# EAGLE design buck (EAGLE 9.5.2)
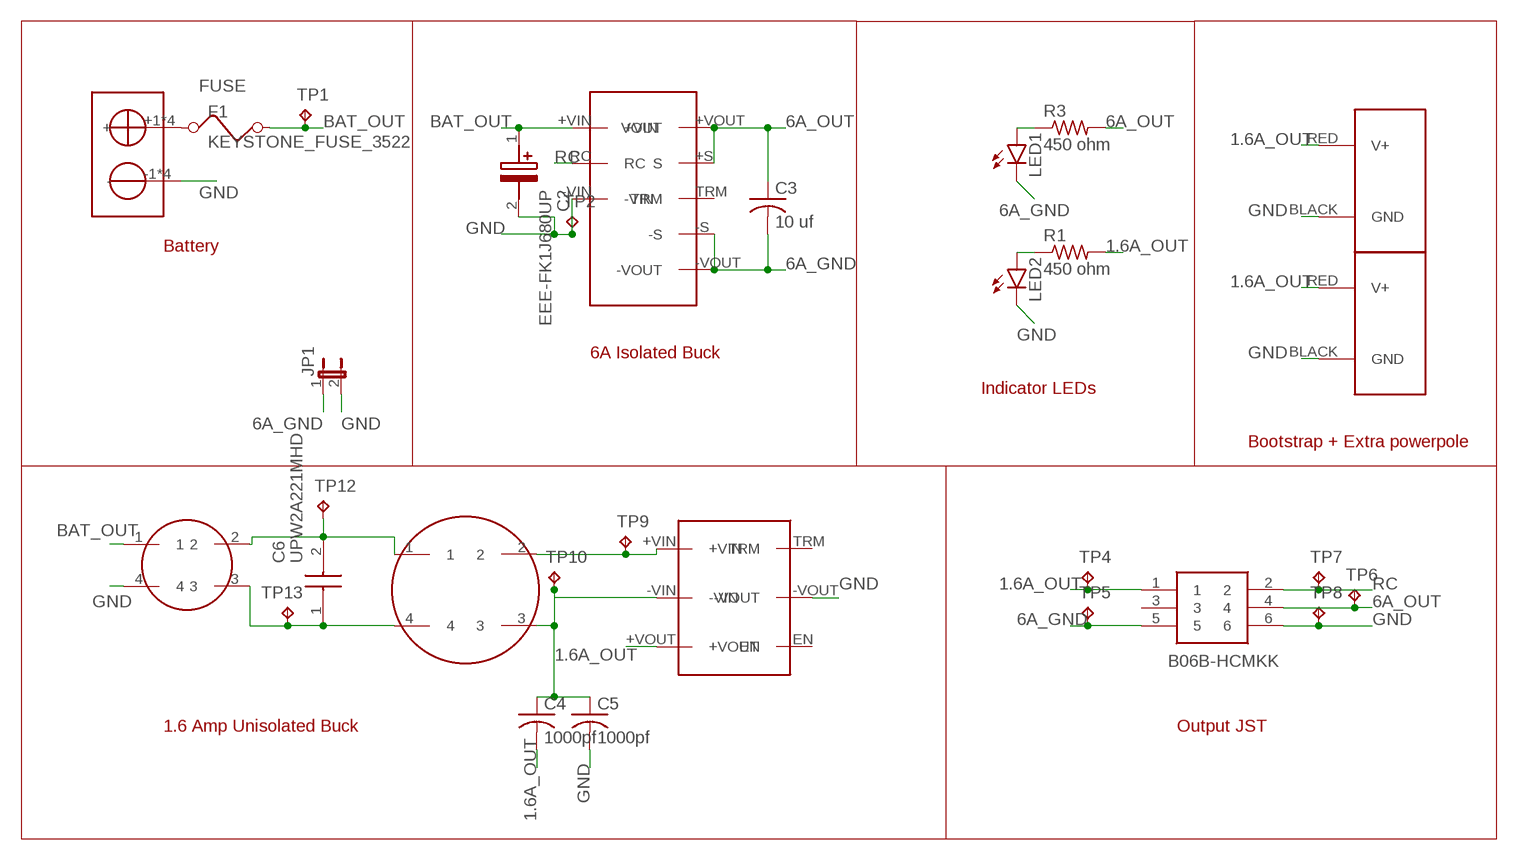
[diagram p0: schematic, sheet 1]

## Parts
BUCK150UH  CMNMODECHOKE150UH  [CMNMODECHOKE150UH]
C2  EEE-FK1J680UP  [CAPAE830X1050N]
C3  10 uf  C-USC0805  [C0805]
C4  1000pf  C-USC0805  [C0805]
C5  1000pf  C-USC0805  [C0805]
C6  UPW2A221MHD  [CAPPRD550W60D1050H1750]
CHOKEME  CMNMODECHOKE1.2MH  [CMNMODECHOKE1.2MH]
F1  KEYSTONE_FUSE_3522  [KEYSTONE_FUSE_3522]
J1  B06B-HCMKK  [B06BHCMKK]
J2  POWERPOLE_POWER45A_DRILL  [POWERPOLE_PAIR_45A_HOLE]
J3  POWERPOLE_POWER45A_DRILL  [POWERPOLE_PAIR_45A_HOLE]
JP1  JP1E  [JP1]
LED1  LEDCHIP-LED0603  [CHIP-LED0603]
LED2  LEDCHIP-LED0603  [CHIP-LED0603]
R1  450 ohm  R-US_R0805  [R0805]
R3  450 ohm  R-US_R0805  [R0805]
TP1  TPPAD1-13  [P1-13]
TP2  TPPAD1-13  [P1-13]
TP4  TPPAD1-13  [P1-13]
TP5  TPPAD1-13  [P1-13]
TP6  TPPAD1-13  [P1-13]
TP7  TPPAD1-13  [P1-13]
TP8  TPPAD1-13  [P1-13]
TP9  TPPAD1-13  [P1-13]
TP10  TPPAD1-13  [P1-13]
TP12  TPPAD1-13  [P1-13]
TP13  TPPAD1-13  [P1-13]
U$1  12V6ABUCKCONVERTER  [12V6ABUCKCONVERTER]
U$2  SB50  [MINI-SB-50]
U$3  BUCK1.6A  [BUCK1.6A]

## Nets
1.6A_OUT: C4.2 J1.1 J2.RED(V+) J3.RED(V+) R1.2 TP4.TP U$3.+VOUT
6A_GND [Power]: C3.2 J1.5 JP1.1 LED1.C TP5.TP U$1.-S U$1.-VOUT
6A_OUT [Power]: C3.1 J1.4 R3.2 TP6.TP U$1.+S(S) U$1.+VOUT(VOUT)
BAT_OUT [Power]: BUCK150UH.1 C2.1(+) F1.B1 F1.B2 TP1.TP U$1.+VIN
FUSE [Power]: F1.A1 F1.A2 U$2.+1(+) U$2.+2(+) U$2.+3(+) U$2.+4(+)
GND [Power]: BUCK150UH.4 C2.2(-) C5.2 J1.6 J2.BLACK(GND) J3.BLACK(GND) JP1.2 LED2.C TP2.TP TP8.TP U$1.-VIN U$2.-1(-) U$2.-2(-) U$2.-3(-) U$2.-4(-) U$3.-VOUT
N$1: BUCK150UH.2 C6.2(-) CHOKEME.1 TP12.TP
N$4: BUCK150UH.3 C6.1(+) CHOKEME.4 TP13.TP
N$6: CHOKEME.2 TP9.TP U$3.+VIN
N$8: C4.1 C5.1 CHOKEME.3 TP10.TP U$3.-VIN
N$10: LED2.A R1.1
N$24: LED1.A R3.1
RC: J1.2 TP7.TP U$1.RC
Unconnected: J1.3 U$1.TRM U$3.EN U$3.TRM

## Notes on the sheet
- Battery
- 6A Isolated Buck
- Indicator LEDs
- Bootstrap + Extra powerpole
- 1.6 Amp Unisolated Buck | Output JST

## Library data of the parts
BUCK150UH = cmnModeChoke150uH:CMNMODECHOKE150UH
C2 = SamacSys_Parts:EEE-FK1J680UP: Aluminum Electrolytic Capacitors - SMD 68UF 63V FK SMD Source: Datasheet <https://componentsearchengine.com/Datasheets/1/EEE-FK1J680UP.pdf>; DESCRIPTION: Aluminum Electrolytic Capacitors - SMD 68UF 63V FK SMD; HEIGHT: 10.5mm; MANUFACTURER_NAME: Panasonic; MANUFACTURER_PART_NUMBER: EEE-FK1J680UP; MOUSER_PART_NUMBER: 667-EEE-FK1J680UP; MOUSER_PRICE-STOCK: https://www.mouser.com/Search/Refine.aspx?Keyword=667-EEE-FK1J680UP
C3-C5 = rcl:C-US: CAPACITOR, American symbol; SPICEPREFIX: C
C6 = SamacSys_Parts:UPW2A221MHD: Nichicon 220F +/-20% 100 V dc Through Hole Radial Aluminium Electrolytic Capacitor Source: Datasheet <https://componentsearchengine.com/Datasheets/1/UPW2A221MHD.pdf>; DESCRIPTION: Nichicon 220F +/-20% 100 V dc Through Hole Radial Aluminium Electrolytic Capacitor; HEIGHT: 17.5mm; MANUFACTURER_NAME: Nichicon; MANUFACTURER_PART_NUMBER: UPW2A221MHD; MOUSER_PART_NUMBER: 647-UPW2A221MHD; MOUSER_PRICE-STOCK: https://www.mouser.com/Search/Refine.aspx?Keyword=647-UPW2A221MHD
CHOKEME = cmnModeChoke1.2mH:CMNMODECHOKE1.2MH
F1 = AUX Lib:KEYSTONE_FUSE_3522
J1 = B06B-HCMKK:B06B-HCMKK: Automotive Connectors 6P AIT Header Top Position (BLK) Source: Datasheet <https://componentsearchengine.com/Datasheets/1/B06B-HCMKK.pdf>; DESCRIPTION: Automotive Connectors 6P AIT Header Top Position (BLK); HEIGHT: 13.7mm; MANUFACTURER_NAME: JST (JAPAN SOLDERLESS TERMINALS); MANUFACTURER_PART_NUMBER: B06B-HCMKK; MOUSER_PART_NUMBER: 306-B06B-HCMKK; MOUSER_PRICE-STOCK: https://www.mouser.com/Search/Refine.aspx?Keyword=306-B06B-HCMKK
J2 J3 = powerpoles:POWERPOLE_POWER: Anderson Powerpole Power Connector using ameteur radio standard layout
JP1 = jumper:JP1E: JUMPER
LED1 LED2 = led:LED: LED OSRAM: - CHIPLED LG R971, LG N971, LY N971, LG Q971, LY Q971, LO R971, LY R971 LH N974, LH R974 LS Q976, LO Q976, LY Q976 LO Q996 - Hyper CHIPLED LW Q18S LB Q993, LB Q99A, LB R99A - SideLED LS A670, LO A670, LY A670, LG A670, LP A670 LB A673, LV A673, LT A673, LW A673 LH A674 LY A675 LS A676, LA A676, LO A676, LY A676, LW A676 LS A679, LY A679, LG A679 - Hyper Micro SIDELED® LS Y876, LA Y876, LO Y876, LY Y876 LT Y87S - SmartLED LW L88C, LW L88S LB L89C, LB L89S, LG L890 LS L89K, LO L89K, LY L89K LS L896, LA L896, LO L896, LY L896 - TOPLED LS T670, LO T670, LY T670, LG T670, LP T670 LSG T670, LSP T670, LSY T670, LOP T670, LYG T670 LG T671, LOG T671, LSG T671 LB T673, LV T673, LT T673, LW T673 LH T674 LS T676, LA T676, LO T676, LY T676, LB T676, LH T676, LSB T676, LW T676 LB T67C, LV T67C, LT T67C, LS T67K, LO T67K, LY T67K, LW E67C LS E67B, LA E67B, LO E67B, LY E67B, LB E67C, LV E67C, LT E67C LW T67C LS T679, LY T679, LG T679 LS T770, LO T770, LY T770, LG T770, LP T770 LB T773, LV T773, LT T773, LW T773 LH T774 LS E675, LA E675, LY E675, LS T675 LS T776, LA T776, LO T776, LY T776, LB T776 LHGB T686 LT T68C, LB T68C - Hyper Mini TOPLED® LB M676 - Mini TOPLED Santana® LG M470 LS M47K, LO M47K, LY M47K Source: http://www.osram.convergy.de LUXEON: - LUMILED® LXK2-PW12-R00, LXK2-PW12-S00, LXK2-PW14-U00, LXK2-PW14-V00 LXK2-PM12-R00, LXK2-PM12-S00, LXK2-PM14-U00 LXK2-PE12-Q00, LXK2-PE12-R00, LXK2-PE12-S00, LXK2-PE14-T00, LXK2-PE14-U00 LXK2-PB12-K00, LXK2-PB12-L00, LXK2-PB12-M00, LXK2-PB14-N00, LXK2-PB14-P00, LXK2-PB14-Q00 LXK2-PR12-L00, LXK2-PR12-M00, LXK2-PR14-Q00, LXK2-PR14-R00 LXK2-PD12-Q00, LXK2-PD12-R00, LXK2-PD12-S00 LXK2-PH12-R00, LXK2-PH12-S00 LXK2-PL12-P00, LXK2-PL12-Q00, LXK2-PL12-R00 Source: www.luxeon.com KINGBRIGHT: KA-3528ASYC Source: www.kingbright.com
R1 R3 = rcl:R-US_: RESISTOR, American symbol; SPICEPREFIX: R
TP1 TP2 TP4-TP10 TP12 TP13 = testpad:TP: Test pad
U$1 = 12v6aBuckConverter:12V6ABUCKCONVERTER
U$2 = REV BLDC:SB50
U$3 = buck_1.6:BUCK1.6A

## Net classes
0 default: width 0.762 mm
1 Power: width 1.524 mm

## Board
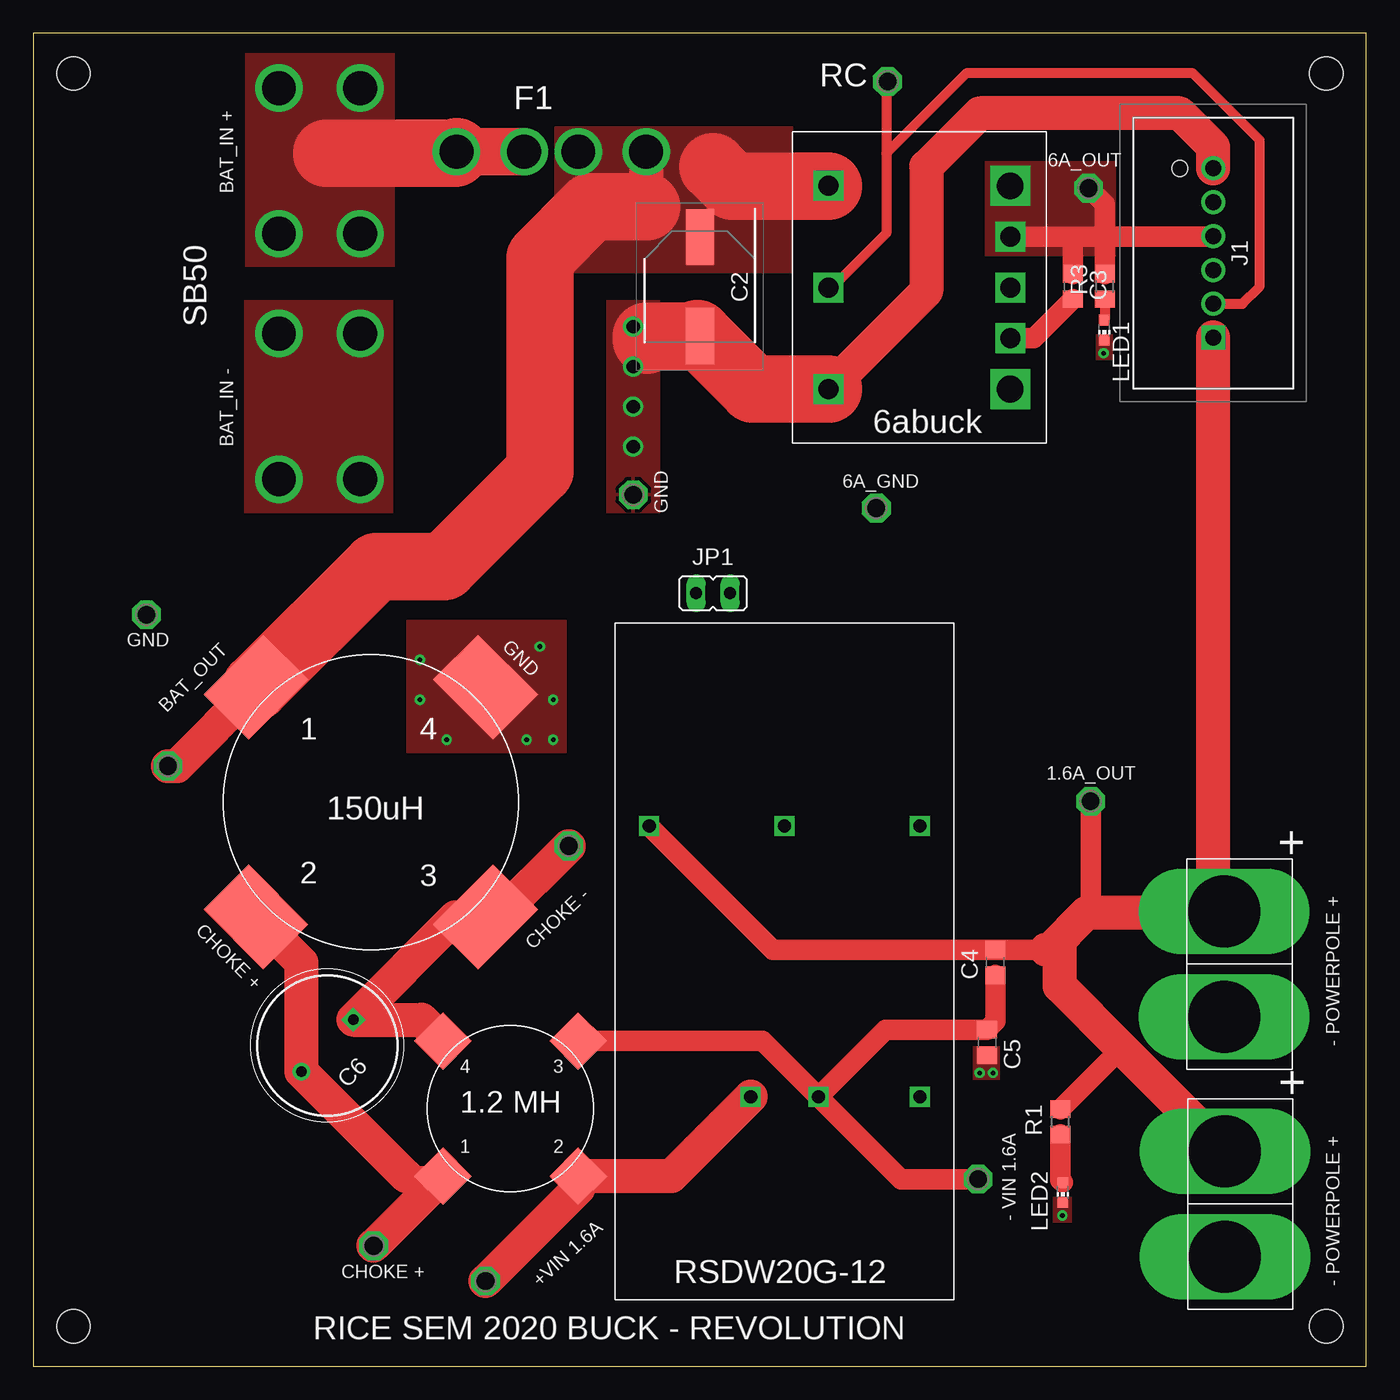
[diagram p1: board, top side]
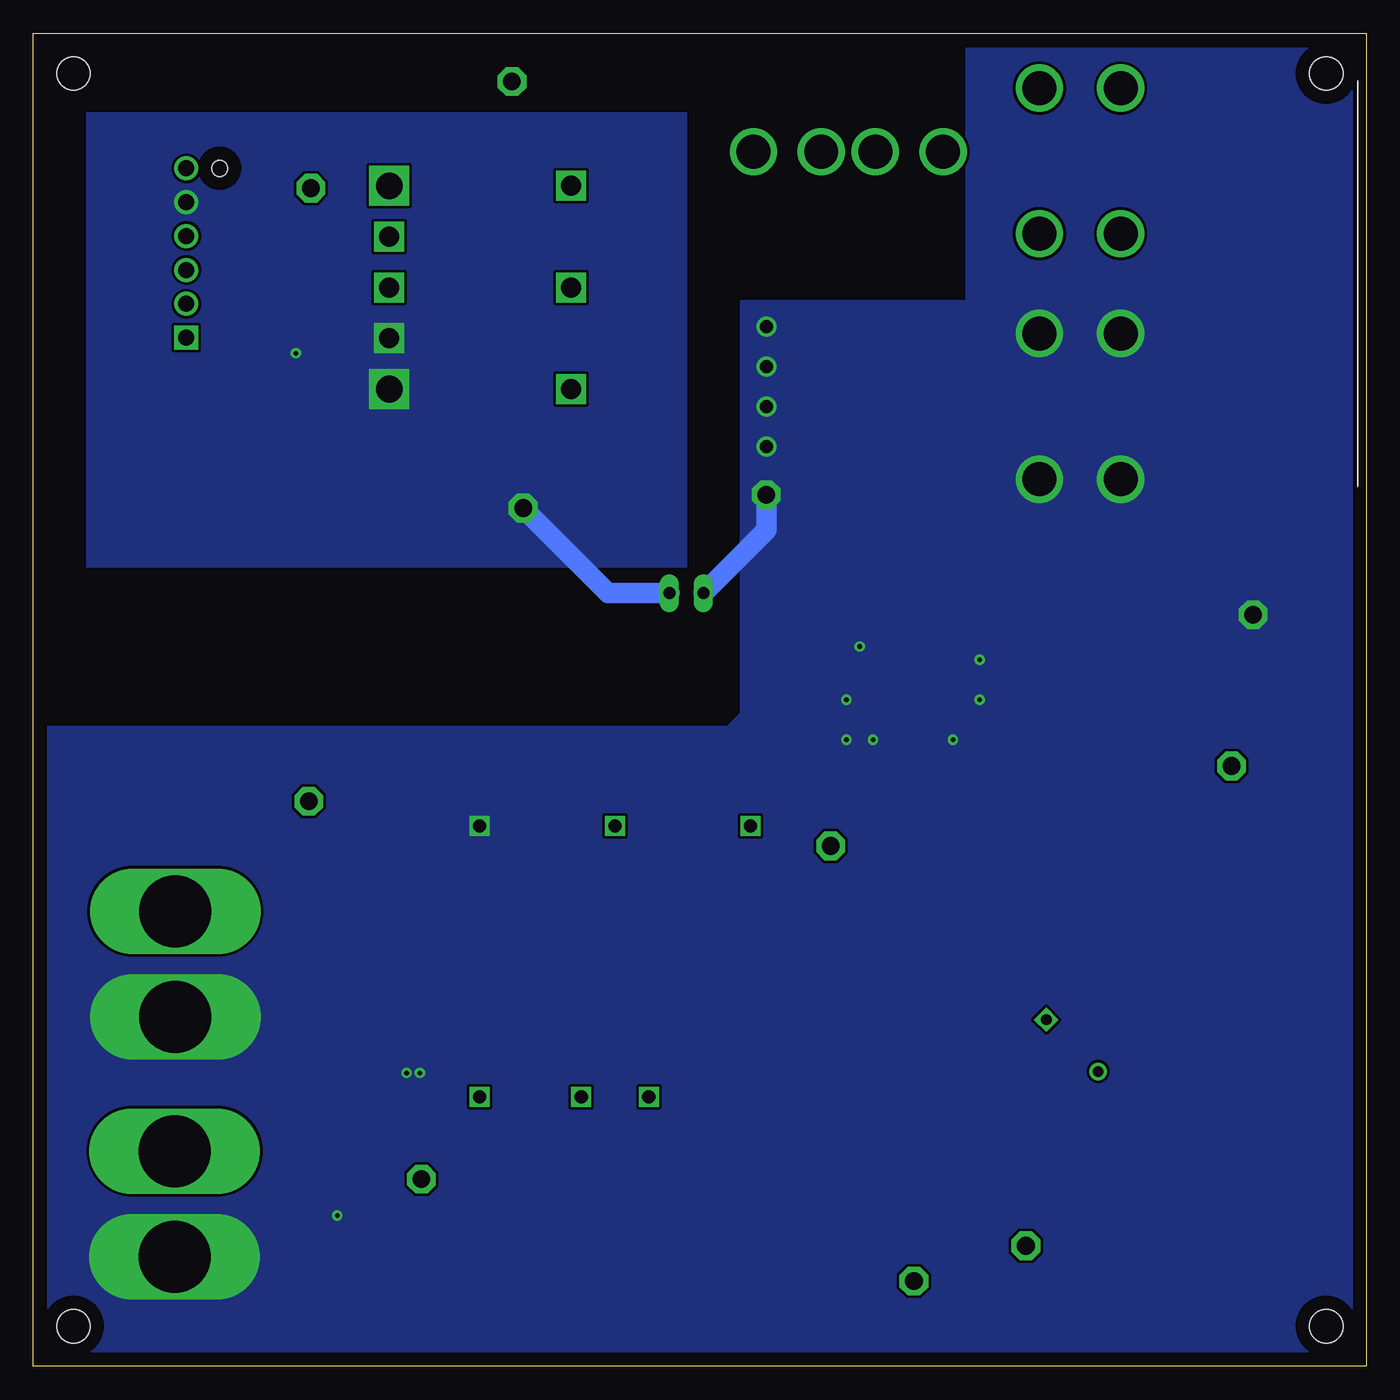
[diagram p2: board, bottom side, seen from below]

Size 100 x 100 mm. Coordinates in mm from the lower left corner, seen from the top.
Outline: 0,0 100,0 100,100 0,100 0,0
Copper layers (1*16): Top 0.035mm / dielectric 1.5mm / Bottom 0.035mm
Design rules "default *": minimum track width 6mil, minimum drill 0.35mm, track to track 8mil, track to pad 8mil, pad to pad 8mil, via to via 8mil, smd to smd 6mil, copper to edge 40mil, drill to drill 6mil, minimum pad ring 10mil, minimum via ring 8mil, stop-mask expansion 4mil, vias tented up to drill 0mil, thermal gap 10mil
Holes 2.5 mm at 3,3 3,97 97,97 97,3

### Footprints (pad centres in the part's own frame; a part is rotated, then mirrored left to right if it is on the bottom)
CMNMODECHOKE150UH = smd 4.763 x 6.35: 1 -12.192,0; 3 12.192,0 | smd 6.35 x 4.763: 2 0,-12.192; 4 0,12.192
CAPAE830X1050N = smd 4.2 x 2.1: 1 -3.7,0; 2 3.7,0
C0805 = smd 1.3 x 1.5: 1 -0.95,0; 2 0.95,0
CAPPRD550W60D1050H1750 = drill 0.8 pad 1.2 square: 1 0,0 | drill 0.8 pad 1.2: 2 5.5,0
CMNMODECHOKE1.2MH = smd 3.048 x 3.048: 1 0,7.176; 2 -7.176,0; 3 0,-7.176; 4 7.176,0
KEYSTONE_FUSE_3522 = drill 2.54: A1 -7.112,0; A2 -2.032,0; B1 2.032,0; B2 7.112,0
B06BHCMKK = drill 1.2 pad 1.8 square: 1 0,0 | drill 1.2 pad 1.8: 2 2.54,0; 3 5.08,0; 4 7.62,0; 5 10.16,0; 6 12.7,0 | hole 1.2: 12.7,2.5
POWERPOLE_PAIR_45A_HOLE = drill 5.4 long: BLACK 3.95,-1.15; RED -3.95,-1.15
JP1 = drill 0.914 long: 1 0,-1.27; 2 0,1.27
CHIP-LED0603 = smd 0.8 x 0.8: A 0,-0.75; C 0,0.75
R0805 = smd 1.3 x 1.5: 1 -0.95,0; 2 0.95,0
P1-13 = drill 1.321 pad 2.159 octagon: TP 0,0
12V6ABUCKCONVERTER = drill 1.5 square: +S 6.82,3.81; +VIN -6.82,7.62; -S 6.82,-3.81; -VIN -6.82,-7.62; RC -6.82,0; TRM 6.82,0 | drill 2 square: +VOUT 6.82,7.62; -VOUT 6.82,-7.62
MINI-SB-50 = drill 2.54: +1 -6.096,14.668; +2 0,14.668; +3 -6.096,3.747; +4 0,3.747; -1 -6.096,-3.747; -2 0,-3.747; -3 -6.096,-14.668; -4 0,-14.668
BUCK1.6A = drill 1 square: +VIN 2.54,10.16; +VOUT 10.16,-10.16; -VIN -2.54,10.16; -VOUT -10.16,-10.16; EN -10.16,10.16; TRM 0,-10.16

### Placement (x,y rotation side)
BUCK150UH  25.32,42.32 315 top
C2  50,81 270 top
C3  78,81 270 top
C4  72.17,30.3 90 top
C5  71.55,24.3 270 top
C6  24,26 225 top
CHOKEME  35.8,19.32 135 top
F1  38.86,91.12 0 top
J1  88.52,77.17 90 top
J2  90.55,12.17 270 top
J3  90.5,30.17 270 top
JP1  51,58 90 top
LED1  80.34,77.73 180 top
LED2  77.23,13.03 180 top
R1  77.07,18.33 90 top
R3  80.38,81 90 top
TP1  10.1,45.03 0 top
TP2  8.49,56.38 0 top
TP4  79.33,42.38 0 top
TP5  63.25,64.38 0 top
TP6  79.17,88.38 0 top
TP7  64.09,96.38 0 top
TP8  45.01,65.38 0 top
TP9  33.93,6.38 0 top
TP10  70.88,14.03 0 top
TP12  25.53,9.03 0 top
TP13  40.18,39.03 0 top
U$1  66.47,80.93 0 top
U$2  18.42,81.22 0 bottom
U$3  56.36,30.37 180 top

### Tracks (layer width: path | path; a pad name or v marks a point on that pad's centre or on a via)
1.6A_OUT
  Top 1.524: U$3.+VOUT 55.48,31.25 C4.2 76,31.25 77,31.25 | R1.2 81.55,23.76 81.76,23.76 | TP4.TP 79.33,34.33 79,34
  Top 2.54: J2.RED 81.76,23.76 77,28.52 77,31.25 | J1.1 88.52,34.95 J3.RED 89.23,34 79,34 76.25,31.25 76,31.25
6A_GND  (via drill 0.35)
  Top 1.524: C3.2 75.07,77.12 U$1.-S
  Bottom 1.524: JP1.1 56.87,58 TP5.TP
  other vias: 80.3,76
  pour Bottom (no thermals): 96,94 96,60 51,60 51,94
  pour Top (no thermals): 79.7,77.4 79.7,75.5 81,75.5 81,77.4
6A_OUT
  Top 1.524: U$1.+S 78,84.74 | 78,84.74 88.47,84.74 J1.4 | C3.1 78,84.74 | R3.2 80.38,87.17 TP6.TP
  pour Top (no thermals): 71.4,90.4 71.4,83.3 81.2,83.3 81.2,90.4
BAT_OUT
  Top 2.54: 46,87 46,91.09 F1.B2 | TP1.TP 10.79,45.03 BUCK150UH.1
  Top 5.08: U$1.+VIN 52.45,88.55 51,90 | 46,87 41.85,87 38,83.15 38,67.19 30.81,60 25.76,60 BUCK150UH.1
  pour Top (no thermals): 39.1,93 39.1,82 57,82 57,93
FUSE
  Top 3.556: 22.12,91.12 F1.A2
  Top 3.81: 22,91 22.12,91.12
  Top 5.08: F1.A1 31.63,91 22,91
  pour Top (no thermals): 15.9,98.5 15.9,82.5 27.1,82.5 27.1,98.5
GND  (via drill 0.35, 1)
  Top 2.54: J1.6 88.52,91.48 86,94 71,94 67,90 67,80.66 U$1.-VIN | 46,77 45,77
  Top 5.08: 49.83,77.47 C2.2 | C2.2 53.99,73.31 U$1.-VIN | C2.2 46,77.3 46,77
  Bottom 1.524: JP1.2 45.01,62.72 TP8.TP
  other vias: 29,53 29,50 31,47 37,47 39,47 39,50 38,54 77.2,11.3 71,22 72,22 45,78 45,75 45,72 45,69
  pour Bottom (no thermals): 30,48 30,99.52 0.52,99.52 0.52,1 99,1 99,48
  pour Top (no thermals): 40,56 40,46 28,46 28,56
  pour Top (no thermals): 76.5,12.7 76.5,10.8 77.9,10.8 77.9,12.7
  pour Top (no thermals): 70.5,24 70.5,21.5 72.5,21.5 72.5,24
  pour Top (no thermals): 15.8,80 15.8,64 27,64 27,80
  pour Bottom (no thermals): 16,80 16,47 47,47 47,80
  pour Top: 47,80 47,64 43,64 43,80
  pour Bottom: 30,66 48,48 48,44 26,44 26,66
N$1
  Top 1.524: 27.98,14.25 CHOKEME.1 | 25.53,9.05 TP12.TP
  Top 2.54: BUCK150UH.2 20.11,30.29 C6.2 27.98,14.25 | CHOKEME.1 25.53,9.05
N$4
  Top 1.524: 31.7,33.7 BUCK150UH.3 34.85,33.7
  Top 2.54: 31.7,33.7 C6.1 29.12,26 CHOKEME.4 | TP13.TP 34.85,33.7
N$6
  Top 1.524: CHOKEME.2 40.87,13.32
  Top 2.54: U$3.+VIN 47.86,14.25 CHOKEME.2 | 40.87,13.32 TP9.TP
N$8
  Top 1.524: U$3.-VIN 63.94,25.25 C5.1 72.17,25.87 C4.1 | TP10.TP 65.08,14.03 U$3.-VIN | U$3.-VIN 54.72,24.39 CHOKEME.3
N$10
  Top 1.524: LED2.A 77.07,13.94 R1.1
N$24
  Top 0.762: R3.1 80.38,78.52 LED1.A
RC
  Top 0.762: J1.2 90.71,79.71 92,81 92,92 87,97 70,97 64,91 | 64,91 64,85 59.93,80.93 U$1.RC | TP7.TP 64,96.29 64,91

### Text on the board
tNames: RC | 6A_OUT | BAT_IN + | SB50 | 6abuck | BAT_IN - | 6A_GND | GND | GND | GND | BAT_OUT | 1 | 4 | 1.6A_OUT | 150uH | 2 | 3 | CHOKE - | CHOKE + | - POWERPOLE + | 4 | 3 | 1.2 MH | 1 | 2 | - VIN 1.6A | RSDW20G-12 | CHOKE + | +VIN 1.6A | - POWERPOLE + | RICE SEM 2020 BUCK - REVOLUTION